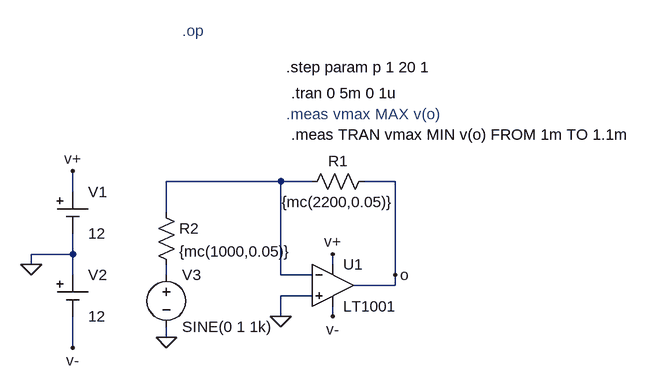
[diagram p0: schematic peorcaso1.asc]
peorcaso1.asc, the LTspice schematic file:
Version 4
SHEET 1 1124 680
WIRE 272 -16 96 -16
WIRE 320 -16 272 -16
WIRE 448 -16 400 -16
WIRE -48 0 -48 -32
WIRE 96 32 96 -16
WIRE -48 96 -48 64
WIRE -48 96 -112 96
WIRE -112 112 -112 96
WIRE 352 112 352 96
WIRE -48 128 -48 96
WIRE 96 128 96 112
WIRE 272 128 272 -16
WIRE 320 128 272 128
WIRE 448 128 448 -16
WIRE 448 144 448 128
WIRE 448 144 384 144
WIRE 320 160 272 160
WIRE 272 192 272 160
WIRE 352 192 352 176
WIRE 96 224 96 208
WIRE -48 240 -48 192
FLAG -112 112 0
FLAG -48 -32 v+
FLAG -48 240 v-
FLAG 352 96 v+
FLAG 352 192 v-
FLAG 272 192 0
FLAG 96 224 0
FLAG 448 128 o
SYMBOL OpAmps\\LT1001 352 80 R0
SYMATTR InstName U1
SYMBOL Misc\\cell -48 0 R0
WINDOW 123 0 0 Left 0
WINDOW 39 0 0 Left 0
SYMATTR InstName V1
SYMATTR Value 12
SYMBOL Misc\\cell -48 128 R0
WINDOW 123 0 0 Left 0
WINDOW 39 0 0 Left 0
SYMATTR InstName V2
SYMATTR Value 12
SYMBOL res 416 -32 R90
WINDOW 0 0 56 VBottom 2
WINDOW 3 32 56 VTop 2
SYMATTR InstName R1
SYMATTR Value {mc(2200,0.05)}
SYMBOL res 80 16 R0
SYMATTR InstName R2
SYMATTR Value {mc(1000,0.05)}
SYMBOL voltage 96 112 R0
WINDOW 123 0 0 Left 0
WINDOW 39 0 0 Left 0
SYMATTR InstName V3
SYMATTR Value SINE(0 1 1k)
TEXT 280 -192 Left 2 !.step param p 1 20 1
TEXT 288 -152 Left 2 !.tran 0 5m 0 1u
TEXT 280 -120 Left 2 ;.meas vmax MAX v(o)
TEXT 120 -248 Left 2 ;.op
TEXT 288 -88 Left 2 !.meas TRAN vmax MIN v(o) FROM 1m TO 1.1m

The netlist it stands for:
* peorcaso1.asc
XU1 0 N001 v+ v- o LT1001  ; pins In+ In- V+ V- OUT
V1 v+ 0 12
V2 0 v- 12
R1 o N001 {mc(2200,0.05)}
R2 N001 N002 {mc(1000,0.05)}
V3 N002 0 SINE(0 1 1k)
.step param p 1 20 1
.tran 0 5m 0 1u
* .meas vmax MAX v(o)
* .op
.meas TRAN vmax MIN v(o) FROM 1m TO 1.1m
.lib LTC.lib
.backanno
.end